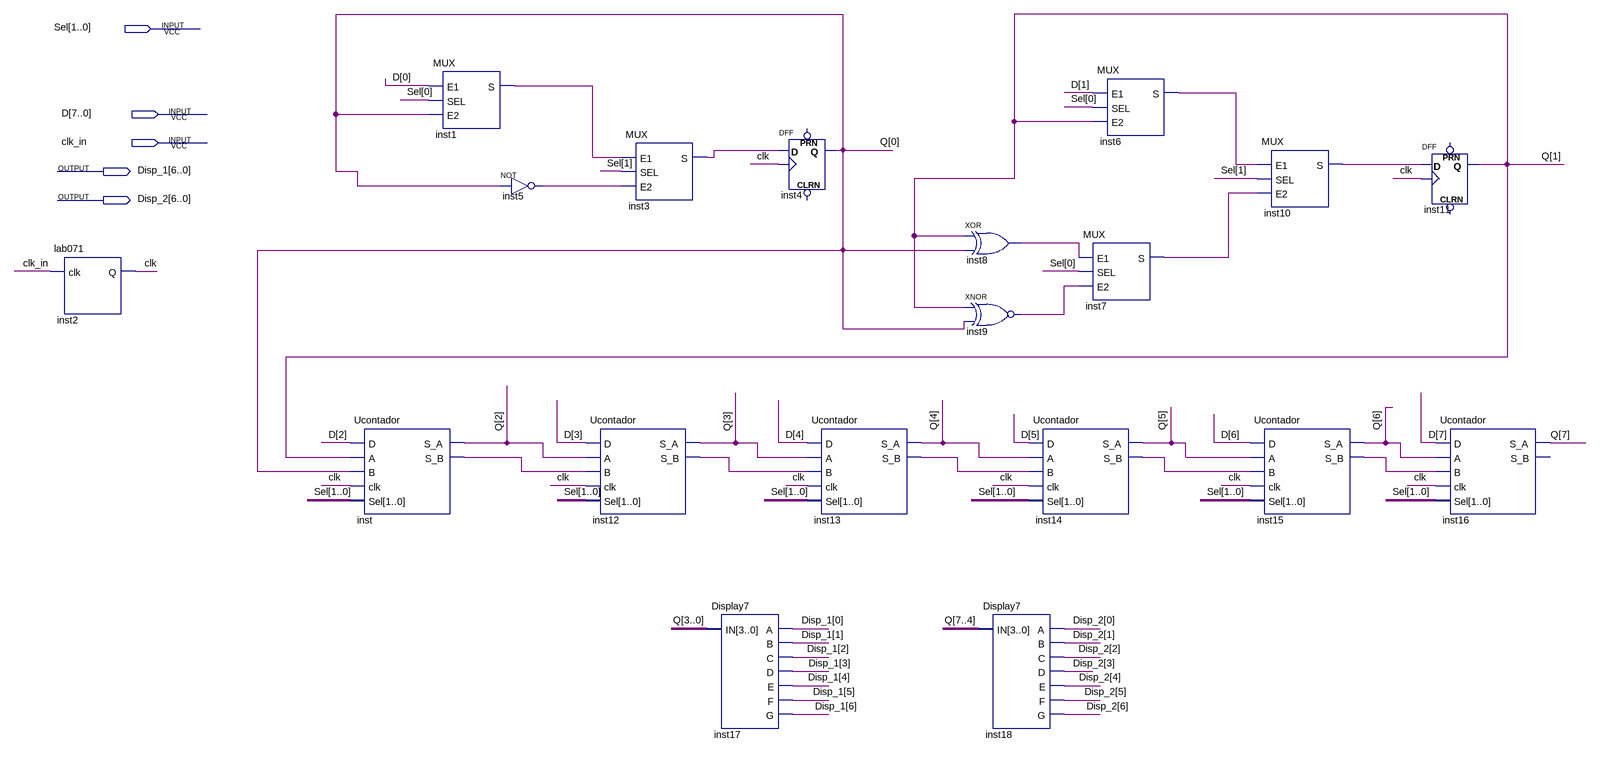
[diagram p0: schematic sheet]
// Quartus schematic LAB08.bdf as structural Verilog: 19 symbols, 5 pins
module LAB08 (
  input  [1:0] Sel,
  input  [7:0] D,
  input  clk_in,
  output [6:0] Disp_1,
  output [6:0] Disp_2
);

  wire clk, inst1_s, inst3_s, inst5_out, inst6_s, inst7_s, inst8_out, inst9_out, inst10_s, inst12_s_b,
       inst13_s_b, inst14_s_b, inst15_s_b, inst_s_b;
  wire [7:0] Q;

  lab071 inst2 (.clk(clk_in), .Q(clk));
  Ucontador inst (.D(D[2]), .A(Q[1]), .B(Q[0]), .clk(clk), .Sel(Sel), .S_A(Q[2]), .S_B(inst_s_b));
  MUX inst1 (.E1(D[0]), .SEL(Sel[0]), .E2(Q[0]), .S(inst1_s));
  not inst5 (inst5_out, Q[0]);
  MUX inst3 (.E1(inst1_s), .SEL(Sel[1]), .E2(inst5_out), .S(inst3_s));
  Ucontador inst12 (.D(D[3]), .A(Q[2]), .B(inst_s_b), .clk(clk), .Sel(Sel), .S_A(Q[3]), .S_B(inst12_s_b));
  Display7 inst17 (
    .IN(Q[3:0]), .A(Disp_1[0]), .B(Disp_1[1]), .C(Disp_1[2]), .D(Disp_1[3]), .E(Disp_1[4]), .F(Disp_1[5]),
    .G(Disp_1[6]));
  DFF inst4 (.CLK(clk), .D(inst3_s), .Q(Q[0]));  // open: CLRN, PRN
  Ucontador inst13 (.D(D[4]), .A(Q[3]), .B(inst12_s_b), .clk(clk), .Sel(Sel), .S_A(Q[4]), .S_B(inst13_s_b));
  xor inst8 (inst8_out, Q[1], Q[0]);
  xnor inst9 (inst9_out, Q[1], Q[0]);
  Ucontador inst14 (.D(D[5]), .A(Q[4]), .B(inst13_s_b), .clk(clk), .Sel(Sel), .S_A(Q[5]), .S_B(inst14_s_b));
  Display7 inst18 (
    .IN(Q[7:4]), .A(Disp_2[0]), .B(Disp_2[1]), .C(Disp_2[2]), .D(Disp_2[3]), .E(Disp_2[4]), .F(Disp_2[5]),
    .G(Disp_2[6]));
  MUX inst7 (.E1(inst8_out), .SEL(Sel[0]), .E2(inst9_out), .S(inst7_s));
  MUX inst6 (.E1(D[1]), .SEL(Sel[0]), .E2(Q[1]), .S(inst6_s));
  MUX inst10 (.E1(inst6_s), .SEL(Sel[1]), .E2(inst7_s), .S(inst10_s));
  Ucontador inst15 (.D(D[6]), .A(Q[5]), .B(inst14_s_b), .clk(clk), .Sel(Sel), .S_A(Q[6]), .S_B(inst15_s_b));
  DFF inst11 (.CLK(clk), .D(inst10_s), .Q(Q[1]));  // open: CLRN, PRN
  Ucontador inst16 (.D(D[7]), .A(Q[6]), .B(inst15_s_b), .clk(clk), .Sel(Sel), .S_A(Q[7]));  // open: S_B
endmodule
